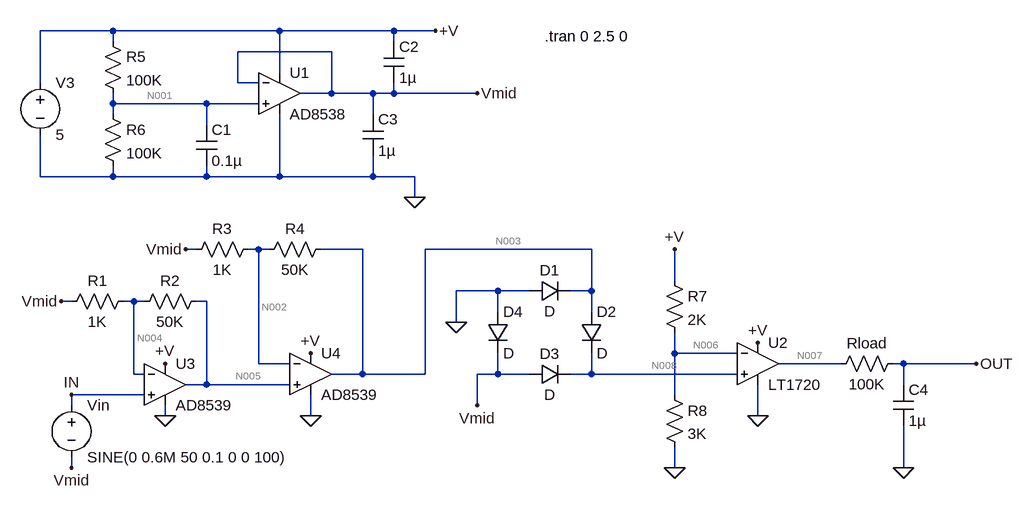
[diagram p0: schematic rogowski-coil-4.asc]
rogowski-coil-4.asc, the LTspice schematic file:
Version 4
SHEET 1 2164 700
WIRE 496 -1648 384 -1648
WIRE 752 -1648 496 -1648
WIRE 928 -1648 752 -1648
WIRE 992 -1648 928 -1648
WIRE 496 -1632 496 -1648
WIRE 928 -1632 928 -1648
WIRE 832 -1616 688 -1616
WIRE 752 -1584 752 -1648
WIRE 384 -1568 384 -1648
WIRE 688 -1568 688 -1616
WIRE 720 -1568 688 -1568
WIRE 832 -1552 832 -1616
WIRE 832 -1552 784 -1552
WIRE 896 -1552 832 -1552
WIRE 928 -1552 928 -1568
WIRE 928 -1552 896 -1552
WIRE 1056 -1552 928 -1552
WIRE 496 -1536 496 -1552
WIRE 640 -1536 496 -1536
WIRE 720 -1536 640 -1536
WIRE 496 -1520 496 -1536
WIRE 896 -1520 896 -1552
WIRE 640 -1504 640 -1536
WIRE 384 -1424 384 -1488
WIRE 496 -1424 496 -1440
WIRE 496 -1424 384 -1424
WIRE 640 -1424 640 -1440
WIRE 640 -1424 496 -1424
WIRE 752 -1424 752 -1520
WIRE 752 -1424 640 -1424
WIRE 896 -1424 896 -1456
WIRE 896 -1424 752 -1424
WIRE 960 -1424 896 -1424
WIRE 960 -1392 960 -1424
WIRE 624 -1312 608 -1312
WIRE 720 -1312 704 -1312
WIRE 736 -1312 720 -1312
WIRE 880 -1312 816 -1312
WIRE 1232 -1312 976 -1312
WIRE 1360 -1264 1360 -1312
WIRE 1088 -1248 1024 -1248
WIRE 1136 -1248 1088 -1248
WIRE 1232 -1248 1232 -1312
WIRE 1232 -1248 1200 -1248
WIRE 432 -1232 416 -1232
WIRE 528 -1232 512 -1232
WIRE 544 -1232 528 -1232
WIRE 640 -1232 624 -1232
WIRE 1088 -1216 1088 -1248
WIRE 1232 -1216 1232 -1248
WIRE 1024 -1200 1024 -1248
WIRE 1360 -1152 1360 -1184
WIRE 1456 -1152 1360 -1152
WIRE 720 -1136 720 -1312
WIRE 768 -1136 720 -1136
WIRE 1616 -1136 1520 -1136
WIRE 1712 -1136 1696 -1136
WIRE 1824 -1136 1712 -1136
WIRE 528 -1120 528 -1232
WIRE 544 -1120 528 -1120
WIRE 880 -1120 880 -1312
WIRE 880 -1120 832 -1120
WIRE 976 -1120 976 -1312
WIRE 976 -1120 880 -1120
WIRE 1088 -1120 1088 -1152
WIRE 1088 -1120 1056 -1120
WIRE 1136 -1120 1088 -1120
WIRE 1232 -1120 1232 -1152
WIRE 1232 -1120 1200 -1120
WIRE 1456 -1120 1232 -1120
WIRE 640 -1104 640 -1232
WIRE 640 -1104 608 -1104
WIRE 768 -1104 640 -1104
WIRE 1712 -1104 1712 -1136
WIRE 544 -1088 432 -1088
WIRE 1360 -1088 1360 -1152
WIRE 432 -1072 432 -1088
WIRE 1056 -1072 1056 -1120
WIRE 576 -1056 576 -1072
WIRE 800 -1056 800 -1088
WIRE 1488 -1056 1488 -1104
WIRE 432 -976 432 -992
WIRE 1360 -976 1360 -1008
WIRE 1712 -976 1712 -1040
FLAG 1824 -1136 OUT
FLAG 432 -1088 IN
FLAG 576 -1136 +V
FLAG 800 -1152 +V
FLAG 960 -1392 0
FLAG 992 -1648 +V
FLAG 1056 -1552 Vmid
FLAG 576 -1056 0
FLAG 800 -1056 0
FLAG 608 -1312 Vmid
FLAG 416 -1232 Vmid
FLAG 432 -976 Vmid
FLAG 1488 -1056 0
FLAG 1488 -1168 +V
FLAG 1360 -976 0
FLAG 1360 -1312 +V
FLAG 1712 -976 0
FLAG 1056 -1072 Vmid
FLAG 1024 -1200 0
SYMBOL voltage 432 -1088 R0
WINDOW 123 24 146 Left 2
WINDOW 39 24 125 Left 2
SYMATTR InstName Vin
SYMATTR Value SINE(0 0.6M 50 0.1 0 0 100)
SYMBOL res 528 -1248 R90
WINDOW 0 0 56 VBottom 2
WINDOW 3 32 56 VTop 2
SYMATTR InstName R1
SYMATTR Value 1K
SYMBOL res 640 -1248 R90
WINDOW 0 0 56 VBottom 2
WINDOW 3 32 56 VTop 2
SYMATTR InstName R2
SYMATTR Value 50K
SYMBOL res 1712 -1152 R90
WINDOW 0 0 56 VBottom 2
WINDOW 3 32 56 VTop 2
SYMATTR InstName Rload
SYMATTR Value 100K
SYMBOL res 720 -1328 R90
WINDOW 0 0 56 VBottom 2
WINDOW 3 32 56 VTop 2
SYMATTR InstName R3
SYMATTR Value 1K
SYMBOL res 832 -1328 R90
WINDOW 0 0 56 VBottom 2
WINDOW 3 32 56 VTop 2
SYMATTR InstName R4
SYMATTR Value 50K
SYMBOL OpAmps\\AD8539 576 -1168 R0
SYMATTR InstName U3
SYMBOL OpAmps\\AD8539 800 -1184 R0
SYMATTR InstName U4
SYMBOL voltage 384 -1584 R0
WINDOW 123 0 0 Left 0
WINDOW 39 0 0 Left 0
SYMATTR InstName V3
SYMATTR Value 5
SYMBOL res 480 -1648 R0
SYMATTR InstName R5
SYMATTR Value 100K
SYMBOL res 480 -1536 R0
SYMATTR InstName R6
SYMATTR Value 100K
SYMBOL OpAmps\\AD8538 752 -1616 R0
SYMATTR InstName U1
SYMBOL cap 624 -1504 R0
SYMATTR InstName C1
SYMATTR Value 0.1µ
SYMBOL cap 912 -1632 R0
SYMATTR InstName C2
SYMATTR Value 1µ
SYMBOL cap 880 -1520 R0
SYMATTR InstName C3
SYMATTR Value 1µ
SYMBOL Comparators\\LT1720 1488 -1200 R0
SYMATTR InstName U2
SYMBOL res 1344 -1280 R0
SYMATTR InstName R7
SYMATTR Value 2K
SYMBOL res 1344 -1104 R0
SYMATTR InstName R8
SYMATTR Value 3K
SYMBOL cap 1696 -1104 R0
SYMATTR InstName C4
SYMATTR Value 1µ
SYMBOL diode 1136 -1232 R270
WINDOW 0 32 32 VTop 2
WINDOW 3 0 32 VBottom 2
SYMATTR InstName D1
SYMBOL diode 1216 -1216 R0
SYMATTR InstName D2
SYMBOL diode 1136 -1104 R270
WINDOW 0 32 32 VTop 2
WINDOW 3 0 32 VBottom 2
SYMATTR InstName D3
SYMBOL diode 1072 -1216 R0
SYMATTR InstName D4
TEXT 1160 -1640 Left 2 !.tran 0 2.5 0

The netlist it stands for:
* rogowski-coil-4.asc
Vin IN Vmid SINE(0 0.6M 50 0.1 0 0 100)
R1 N004 Vmid 1K
R2 N005 N004 50K
Rload OUT N007 100K
R3 N002 Vmid 1K
R4 N003 N002 50K
XU3 IN N004 +V 0 N005 AD8539  ; pins In+ In- V+ V- OUT
XU4 N005 N002 +V 0 N003 AD8539  ; pins In+ In- V+ V- OUT
V3 +V 0 5
R5 +V N001 100K
R6 N001 0 100K
XU1 N001 Vmid +V 0 Vmid AD8538  ; pins In+ In- V+ V- OUT
C1 N001 0 0.1µ
C2 +V Vmid 1µ
C3 Vmid 0 1µ
XU2 N008 N006 +V 0 N007 LT1720  ; pins In+ In- V+ V- OUT
R7 +V N006 2K
R8 N006 0 3K
C4 OUT 0 1µ
D1 0 N003 D
D2 N003 N008 D
D3 Vmid N008 D
D4 0 Vmid D
.model D D
.lib standard.dio
.tran 0 2.5 0
.lib LT1720.sub
.backanno
.end

* Results of the author's LTspice run, read from the files saved beside the schematic
* Operating Point, zero values left out:
*   V(in) = 2.5 V
*   V(vmid) = 2.5 V
*   V(n004) = 2.5 V
*   V(n005) = 2.501 V
*   V(out) = 4.817 V
*   V(n007) = 4.819 V
*   V(n002) = 2.501 V
*   V(n003) = 2.536 V
*   V(+v) = 5 V
*   V(n001) = 2.5 V
*   V(n006) = 3.006 V
*   V(n008) = 3.892 V
*   I(C4) = 19.89 nA
*   I(D4) = -2.51 pA
*   I(D3) = -1.402 pA
*   I(D2) = -1.365 pA
*   I(D1) = -2.546 pA
*   I(R8) = 1.002 mA
*   I(R7) = 997 µA
*   I(R6) = 25 µA
*   I(R5) = 25 µA
*   I(R4) = 713.9 nA
*   I(R3) = 713.9 nA
*   I(Rload) = -19.89 nA
*   I(R2) = 13.73 nA
*   I(R1) = 13.74 nA
*   I(V3) = -5.458 mA
*   I(Vin) = -10 pA
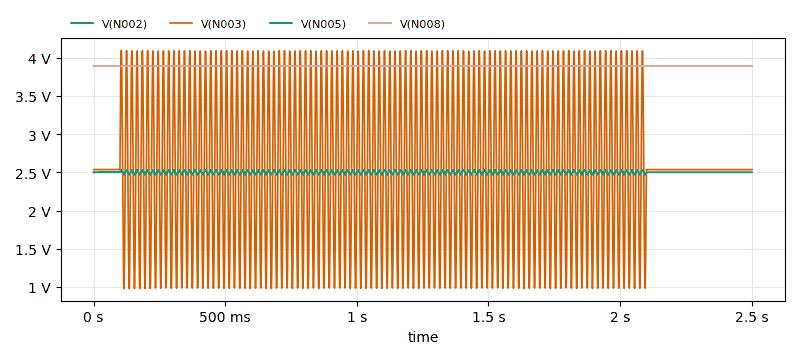
[diagram p1: Transient Analysis of rogowski-coil-4.asc, plotted from the saved traces]
* Transient Analysis, 1 run:
*   V(N002): min 2.47 V, max 2.531 V, average 2.501 V, rms 2.501 V, last 2.501 V
*   V(N003): min 976 mV, max 4.097 V, average 2.537 V, rms 2.718 V, last 2.536 V
*   V(N005): min 2.47 V, max 2.531 V, average 2.501 V, rms 2.501 V, last 2.501 V
*   V(N008): min 3.891 V, max 3.898 V, average 3.892 V, rms 3.892 V, last 3.892 V